# EAGLE design ADSB_AMP_V2 (EAGLE 6.2)
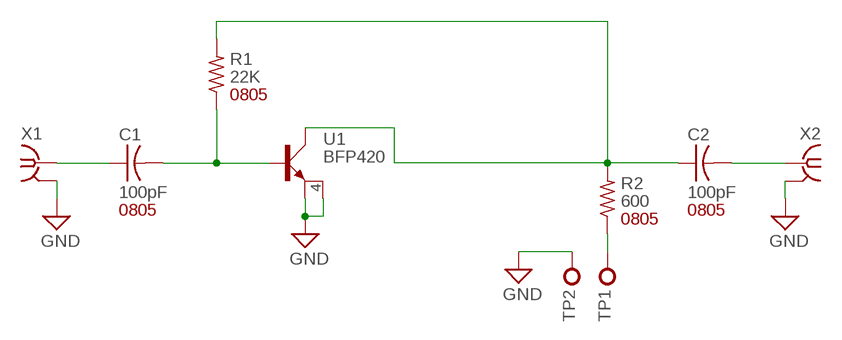
[diagram p0: schematic, sheet 1]

## Parts
C1  100pF  CAP0805  [0805]
C2  100pF  CAP0805  [0805]
R1  22K  RES0805  [0805]
R2  600  RES0805  [0805]
TP1  TEST_POINTS76_150  [SMD_76_150]
TP2  TEST_POINTS76_150  [SMD_76_150]
U1  BFP420  [SOT343_INFINEON]
X1  SMA-142-0701-801/806  [J502-ND-142-0701-801/806]
X2  SMA-142-0701-801/806  [J502-ND-142-0701-801/806]

## Nets
GND: TP2.1(MP) U1.2(E1) U1.4(E2) X1.G@1(GND) X2.G@1(GND)
N$1: C1.1 X1.1
N$2: C1.2 R1.1 U1.1(B)
N$4: C2.1 R1.2 R2.2 U1.3(C)
N$5: R2.1 TP1.1(MP)
N$6: C2.2 X2.1

## Notes on the sheet
- 0805
- 0805 | 0805
- 0805

## Power pins joined to a net without a drawn wire
GND: X1.G@2(GND) X1.G@3(GND) X1.G@4(GND) X2.G@2(GND) X2.G@3(GND) X2.G@4(GND)

## Library data of the parts
C1 C2 = Passives:CAP: Capacitor, Capacitor
R1 R2 = Passives:RES: Resistor, Resistor
TP1 TP2 = Pads_Test_Points:TEST_POINT: Test Point
U1 = transistor-small-signal:BFP420
X1 X2 = con-coax:SMA-: SMA 50 Ohm End Launch Jack Receptacle - Round Contact Johnson Components Source: www.johnsoncomponents.com .. J502-ND.pdf; MF: JOHNSON COMPONENTS; MPN: 142-0701-801; OC_FARNELL: 1608592; OC_NEWARK: 90F2624

## Board
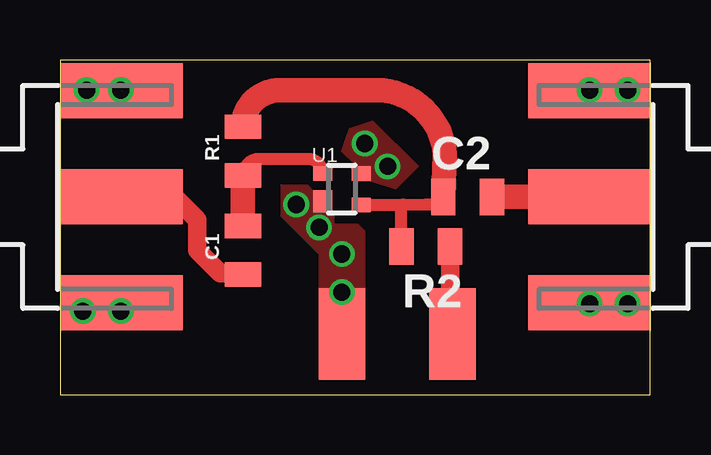
[diagram p1: board, top side]
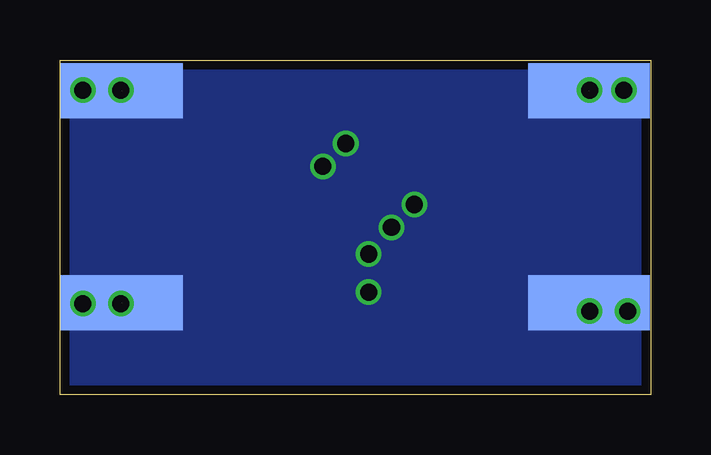
[diagram p2: board, bottom side, seen from below]

Size 24.61 x 13.96 mm. Coordinates in mm from the lower left corner, seen from the top.
Outline: 0,0 24.59,0 24.59,13.96 0,13.96 0,0
Copper layers (1*16): Top 0.0356mm / dielectric 1.5011mm / Bottom 0.0356mm
Design rules: minimum track width 6mil, minimum drill 13mil, track to track 6mil, track to pad 6mil, pad to pad 6mil, via to via 6mil, smd to smd 6mil, copper to edge 15mil, drill to drill 6mil, minimum pad ring 7mil, minimum via ring 7mil, stop-mask expansion 4mil, vias tented up to drill 0mil, thermal gap 10mil

### Footprints (pad centres in the part's own frame; a part is rotated, then mirrored left to right if it is on the bottom)
0805 = smd 1.016 x 1.524: 1 -1.016,0; 2 1.016,0
SMD_76_150 = smd 1.93 x 3.81: 1 0,0
SOT343_INFINEON = smd 0.6 x 0.8: 1 -0.65,-0.8; 3 0.65,0.8; 4 -0.65,0.8 | smd 0.9 x 0.8: 2 0.5,-0.8
J502-ND-142-0701-801/806 = smd 5.08 x 2.286: 1 2.565,0; G@1 2.565,4.42; G@2 2.565,-4.42 | smd 5.08 x 2.286 bottom: G@3 2.565,4.42; G@4 2.565,-4.42

### Placement (x,y rotation side)
C1  7.62,6.03 90 top
C2  16.99,8.25 0 top
R1  7.62,10.16 90 top
R2  15.24,6.19 180 top
TP1  16.35,2.54 0 top
TP2  11.75,2.54 180 top
U1  11.75,8.57 270 top
X1  0,8.25 0 top
X2  24.61,8.25 180 top

### Tracks (layer width: path | path; a pad name or v marks a point on that pad's centre or on a via)
GND  (via drill 0.71 pad 0.76, 0.71 pad 0.89)  (3 unrouted)
  Top 0.762: X1.G@4 2.56,3.52 v2.54,3.49 v0.95,3.49
  other vias: 2.54,12.7 22.07,12.7 23.65,12.7 22.07,3.81 23.65,3.81 12.7,10.48 13.65,9.53 10.79,6.99 9.84,7.94 1.11,12.7 11.75,5.87 11.75,4.29
  pour Bottom (no thermals): 0,0 24.61,0 24.61,13.97 0,13.97
  pour Top (no thermals): 12.38,8.89 12.38,9.53 11.75,10.16 12.06,11.11 13.02,11.43 14.92,9.53 13.97,8.57 13.02,8.89
  pour Top (no thermals): 11.27,8.41 10.64,8.41 10.32,8.73 9.21,8.73 9.21,7.46 10.48,6.19 11.27,6.19 11.43,6.35 11.43,7.62 11.27,7.62
  pour Top (no thermals): 10.79,4.45 10.79,5.87 10.48,6.19 11.27,6.19 11.43,6.35 11.43,7.14 12.38,7.14 12.7,6.83 12.7,4.29 12.7,0.64 10.79,0.64
N$1
  Top 0.762: X1.1 4.76,8.25 5.71,7.3 5.71,6.03 6.67,5.08 7.56,5.08 C1.1
N$2
  Top 0.508: R1.1 arc-90 8.32,9.84 10.32,9.84 10.33,9.84 arc-90 U1.1
  Top 1.016: C1.2 R1.1
N$4
  Top 0.508: U1.3 14.29,7.93 | 14.29,7.93 15.24,7.94 15.65,7.94 C2.1 | R2.2 14.22,7.87 14.29,7.93
  Top 1.016: R1.2 arc-90 9.14,12.7 13.18,12.7 arc-87 16.03,10 C2.1
N$5
  Top 0.762: R2.1 16.26,2.64 TP1.1
N$6
  Top 1.016: C2.2 X2.1